# Altium project OVSR.PrjPcb
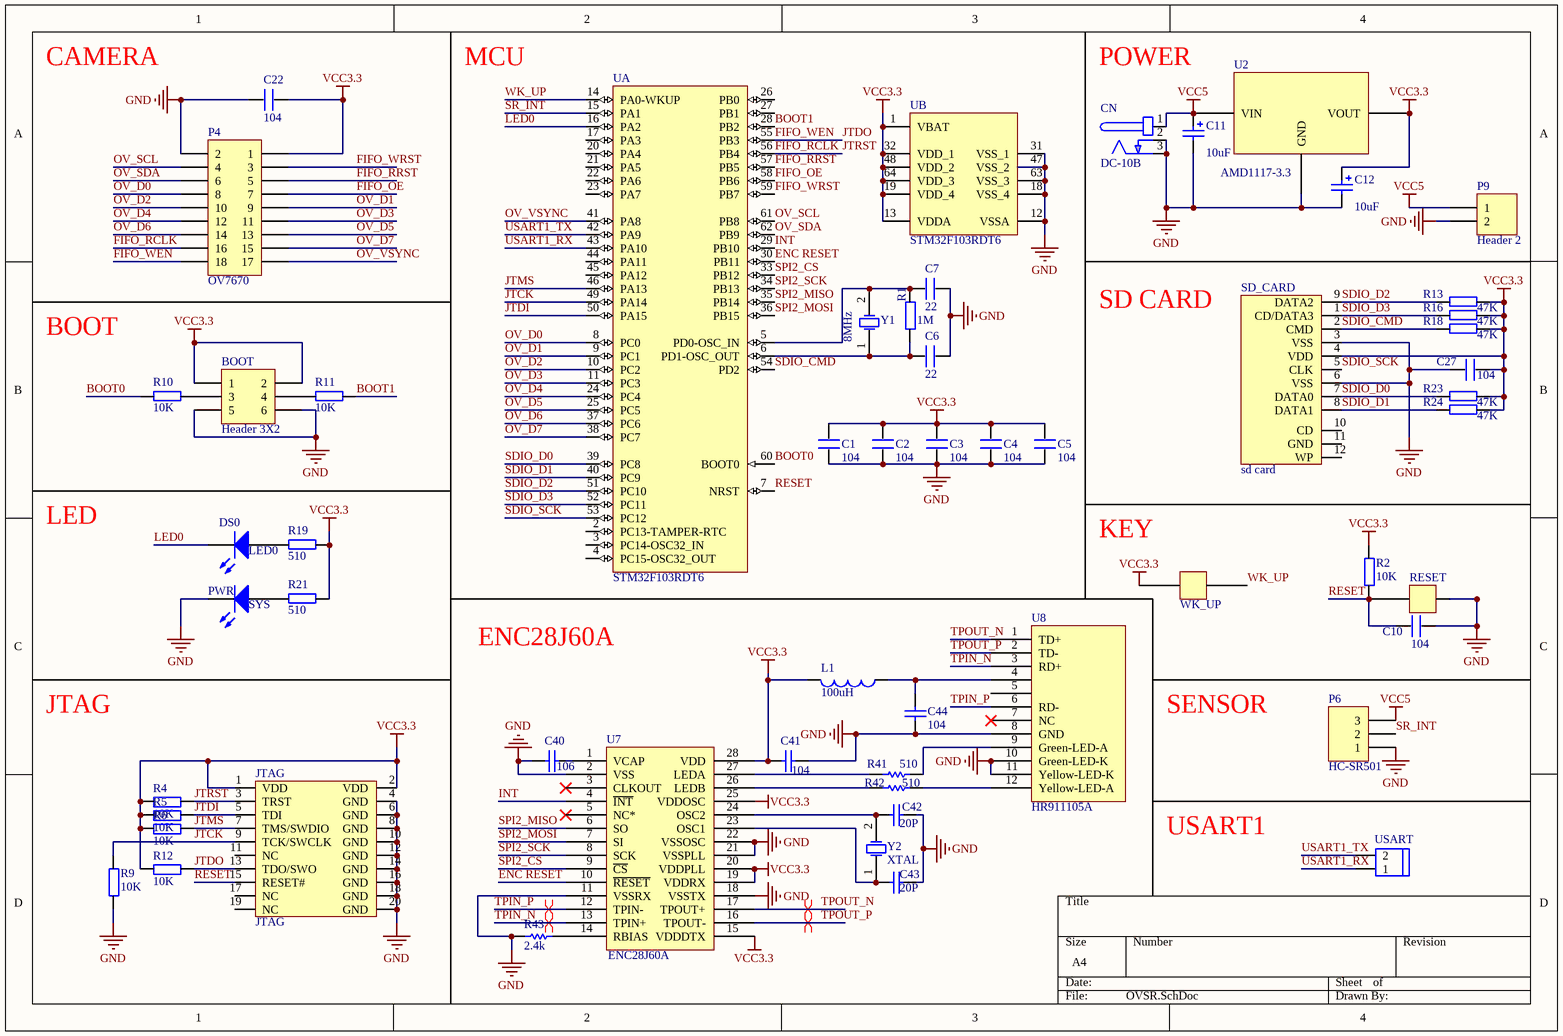
[diagram p0: OVSR.SchDoc]
1 sheet, 55 parts. Net scope: global (net labels, ports and power ports of the same name join across sheets).
Board file: OVSR.PcbDoc

## Sheet OVSR.SchDoc
size A4

### Parts
BOOT  Header 3X2  [HDR2X3]
C1  104  [CC1608-0603]
C2  104  [CC1608-0603]
C3  104  [CC1608-0603]
C4  104  [CC1608-0603]
C5  104  [CC1608-0603]
C6  22  [CC1608-0603]
C7  22  [CC1608-0603]
C10  104  [CC1608-0603]
C11  value 10uF  [CC1608-0603]  (hidden comment: Cap Pol2)
C12  value 10uF  [CC1608-0603]  (hidden comment: Cap Pol2)
C22  104  [CC1608-0603]
C27  104  [CC1608-0603]
C40  value 106  [Cr1608-0603]  (hidden comment: Cap)
C41  value 104  [Cr1608-0603]  (hidden comment: Cap)
C42  value 20P  [Cr1608-0603]  (hidden comment: Cap)
C43  value 20P  [Cr1608-0603]  (hidden comment: Cap)
C44  value 104  [Cr1608-0603]  (hidden comment: Cap)
CN  DC-10B  [DC10B]
DS0  LED0  [Cr2012-0805]
JTAG  JTAG  [JTAG_20]
L1  value 100uH  [1206]  (hidden comment: Inductor)
P4  OV7670  [HDR2X9]
P6  HC-SR501  [5.08-3]
P9  Header 2  [5.08-2]
PWR  SYS  [Cr2012-0805]
R1  1M  [CR1608-0603]
R2  10K  [CR1608-0603]
R4  10K  [CR1608-0603]
R5  10K  [CR1608-0603]
R6  10K  [CR1608-0603]
R9  10K  [CR1608-0603]
R10  10K  [CR1608-0603]
R11  10K  [CR1608-0603]
R12  10K  [CR1608-0603]
R13  47K  [CR1608-0603]
R16  47K  [CR1608-0603]
R18  47K  [CR1608-0603]
R19  510  [CR1608-0603]
R21  510  [CR1608-0603]
R23  47K  [CR1608-0603]
R24  47K  [CR1608-0603]
R41  value 510  [Cr1608-0603]  (hidden comment: Res1)
R42  value 510  [Cr1608-0603]  (hidden comment: Res1)
R43  value 2.4k  [Cr1608-0603]  (hidden comment: Res1)
RESET  SW  [RST_SW]  (value not drawn)
SD_CARD  sd card  [SDCARD_L]
U  STM32F103RDT6  [STM-LQFP64_N]  (parts A,B of 2)
U2  AMD1117-3.3  [SOT230P700X180-4N]
U7  ENC28J60A  [SSOP28_53MM_065P]
U8  HR911105A  [HR911105A]
USART  RS485  [HEAD2L-0.8]  (value not drawn)
WK_UP  SW  [RST_SW]  (value not drawn)
Y1  8MHz  [OSC1]
Y2  XTAL  [XTAL_US]

### Nets
GND: BOOT.5 BOOT.6 C1.1 C2.1 C3.1 C4.1 C5.1 C6.1 C7.1 C10.1 C11.2 C12.2 C22.2 C27.2 C40.1 C41.2 C42.2 C43.2 C44.2 CN.2(GND) CN.3(GND) JTAG.4(GND) JTAG.6(GND) JTAG.8(GND) JTAG.10(GND) JTAG.12(GND) JTAG.14(GND) JTAG.16(GND) JTAG.18(GND) JTAG.20(GND) P4.2 P6.1 P9.2 PWR.2(K) R9.1 R43.2 RESET.2 SD_CARD.3(VSS) SD_CARD.6(VSS) U.12(VSSA) U.18(VSS_4) U.31(VSS_1) U.47(VSS_2) U.63(VSS_3) U2.1(GND) U7.2(VSS) U7.11(VSSRX) U7.18(VSSTX) U7.21(VSSPLL) U7.22(VSSOSC) U8.8(GND) U8.10(Green-LED-K) U8.11(Yellow-LED-K)
VCC3.3: BOOT.1 BOOT.2 C1.2 C2.2 C3.2 C4.2 C5.2 C12.1 C22.1 C27.1 C41.1 JTAG.1(VDD) JTAG.2(VDD) L1.2 P4.1 R2.2 R4.1 R5.1 R6.1 R12.1 R13.1 R16.1 R18.1 R19.1 R21.1 R23.1 R24.1 SD_CARD.4(VDD) U.1(VBAT) U.13(VDDA) U.19(VDD_4) U.32(VDD_1) U.48(VDD_2) U.64(VDD_3) U2.2(VOUT) U7.15(VDDDTX) U7.19(VDDRX) U7.20(VDDPLL) U7.25(VDDOSC) U7.28(VDD) WK_UP.1
VCC5: C11.1 CN.1(+) P6.3 P9.1 U2.3(VIN)
BOOT0: R10.2 U.60(BOOT0)
BOOT1: R11.1 U.28(PB2)
ENC RESET: U.30(PB11) U7.10(~{RESET})
FIFO_OE: P4.7 U.58(PB6)
FIFO_RCLK: JTAG.3(TRST) P4.16 R4.2 U.56(PB4)  [also labelled JTRST]
FIFO_RRST: P4.5 U.57(PB5)
FIFO_WEN: JTAG.13(TDO/SWO) P4.18 R12.2 U.55(PB3)  [also labelled JTDO]
FIFO_WRST: P4.3 U.59(PB7)
INT: U.29(PB10) U7.4(~{INT})
JTCK: JTAG.9(TCK/SWCLK) R9.2 U.49(PA14)
JTDI: JTAG.5(TDI) R5.2 U.50(PA15)
JTMS: JTAG.7(TMS/SWDIO) R6.2 U.46(PA13)
LED0: DS0.2(K) U.16(PA2)
OV_D0: P4.8 U.8(PC0)
OV_D1: P4.9 U.9(PC1)
OV_D2: P4.10 U.10(PC2)
OV_D3: P4.11 U.11(PC3)
OV_D4: P4.12 U.24(PC4)
OV_D5: P4.13 U.25(PC5)
OV_D6: P4.14 U.37(PC6)
OV_D7: P4.15 U.38(PC7)
OV_SCL: P4.4 U.61(PB8)
OV_SDA: P4.6 U.62(PB9)
OV_VSYNC: P4.17 U.41(PA8)
RESET: C10.2 JTAG.15(RESET#) R2.1 RESET.1 U.7(NRST)
SDIO_CMD: R18.2 SD_CARD.2(CMD) U.54(PD2)
SDIO_D0: R23.2 SD_CARD.7(DATA0) U.39(PC8)
SDIO_D1: R24.2 SD_CARD.8(DATA1) U.40(PC9)
SDIO_D2: R13.2 SD_CARD.9(DATA2) U.51(PC10)
SDIO_D3: R16.2 SD_CARD.1(CD/DATA3) U.52(PC11)
SDIO_SCK: SD_CARD.5(CLK) U.53(PC12)
SPI2_CS: U.33(PB12) U7.9(~{CS})
SPI2_MISO: U.35(PB14) U7.6(SO)
SPI2_MOSI: U.36(PB15) U7.7(SI)
SPI2_SCK: U.34(PB13) U7.8(SCK)
SR_INT: P6.2 U.15(PA1)
TPIN_N: U7.13(TPIN+) U8.3(RD+)
TPIN_P: U7.12(TPIN-) U8.6(RD-)
TPOUT_N: U7.17(TPOUT+) U8.1(TD+)
TPOUT_P: U7.16(TPOUT-) U8.2(TD-)
USART1_RX: U.43(PA10) USART.1
USART1_TX: U.42(PA9) USART.2
WK_UP: U.14(PA0-WKUP) WK_UP.2
NetBOOT_3: BOOT.3 R10.1
NetBOOT_4: BOOT.4 R11.2
NetC6_2: C6.2 R1.1 U.6(PD1-OSC_OUT) Y1.1(OSC1)
NetC7_2: C7.2 R1.2 U.5(PD0-OSC_IN) Y1.2(OSC2)
NetC40_2: C40.2 U7.1(VCAP)
NetC42_1: C42.1 U7.24(OSC2) Y2.2(OSC2)
NetC43_1: C43.1 U7.23(OSC1) Y2.1(OSC1)
NetC44_1: C44.1 L1.1 U8.4
NetDS0_1: DS0.1(A) R19.2
NetPWR_1: PWR.1(A) R21.2
NetR41_1: R41.1 U7.27(LEDA)
NetR41_2: R41.2 U8.9(Green-LED-A)
NetR42_1: R42.1 U7.26(LEDB)
NetR42_2: R42.2 U8.12(Yellow-LED-A)
NetR43_1: R43.1 U7.14(RBIAS)

Not connected (* = marked no-connect by the designer): JTAG 11(NC) 17(NC) 19(NC); SD_CARD 10(CD) 11(GND) 12(WP); U 2(PC13-TAMPER-RTC) 3(PC14-OSC32_IN) 4(PC15-OSC32_OUT) 17(PA3) 20(PA4) 21(PA5) 22(PA6) 23(PA7) 26(PB0) 27(PB1) 44(PA11) 45(PA12); U7 3(CLKOUT)* 5(NC*)*; U8 5 7(NC)*

### Layout directives
differential pair: TPIN_N, TPIN_P, TPOUT_N, TPOUT_P

### Notes on the sheet
- CAMERA
- MCU
- POWER
- SD CARD
- BOOT
- LED
- KEY
- ENC28J60A
- JTAG
- SENSOR
- USART1

### Library data of the parts
BOOT = Header 3X2: Header, 3-Pin, Dual row; LatestRevisionDate: 17-Jul-2002; LatestRevisionNote: Re-released for DXP Platform.; Publisher: Altium Limited
C1-C5 C10 C22 C27 = C
C6 C7 = C_1
C11 C12 = Cap Pol2: Polarized Capacitor (Axial); Published: 8-Jun-2000; LatestRevisionDate: 17-Jul-2002; LatestRevisionNote: Re-released for DXP Platform.; Publisher: Altium Limited
C40-C44 = Cap: Capacitor; Published: 8-Jun-2000; LatestRevisionDate: 17-Jul-2002; LatestRevisionNote: Re-released for DXP Platform.; PackageReference: RAD-0.3; Publisher: Altium Limited
CN = PJ202A
DS0 PWR = LED2: Typical RED, GREEN, YELLOW, AMBER GaAs LED; Published: 8-Jun-2000; LatestRevisionDate: 17-Jul-2002; LatestRevisionNote: Re-released for DXP Platform.; PackageDocument: Feb-2002; PackageReference: 3.2X1.6X1.1; Publisher: Altium Limited
L1 = Inductor: Code_IEC: 1005; Published: 8-Jun-2000; LatestRevisionDate: 29-May-2009; LatestRevisionNote: IPC-7351 Footprint Added.; PackageReference: 0402-A; Publisher: Altium Limited; PackageDescription: Chip Inductor; Code_JEITA: 0402
P4 = Header 9X2: Header, 9-Pin, Dual row; LatestRevisionDate: 17-Jul-2002; LatestRevisionNote: Re-released for DXP Platform.; Publisher: Altium Limited
P6 = Header 3: Header, 3-Pin; LatestRevisionDate: 17-Jul-2002; LatestRevisionNote: Re-released for DXP Platform.; Publisher: Altium Limited
P9 = Header 2: Header, 2-Pin; LatestRevisionDate: 17-Jul-2002; LatestRevisionNote: Re-released for DXP Platform.; Publisher: Altium Limited
R1 R2 R4-R6 R9-R13 R16 R18 R19 R21 R23 R24 = R
R41-R43 = Res1: Resistor; Published: 8-Jun-2000; LatestRevisionDate: 17-Jul-2002; LatestRevisionNote: Re-released for DXP Platform.; PackageReference: AXIAL-0.3; Publisher: Altium Limited
U = STM32F103RDT6: ARM Cortex-M3 32-bit MCU, 384 KB Flash, 64 KB Internal RAM, 51 I/Os, 64-pin LQFP, -40 to 85 degC, Tray; A/D Converter: 3x12-bit (16 Channel); D/A Converter: 2x12-bit (2 Channel); FLASH Size (Prog) (kB): 384; I/Os (High Current): 51; Internal RAM Size (kB): 64; Operating Frequency(F) (Processor speed) (MHz): 72; Supply Voltage(Vcc) min (V): 2; DatasheetVersion: Rev. 8; PackageVersion: Rev. 4, 06/2013; PackageReference: LQFP64; PackageDescription: 64-Pin Low Profile Quad Flat Package, 10 x 10 mm Body, 0.5 mm Pitch; Supplier 1: Digi-Key; Supplier Part Number 1: 497-11528-ND; Supplier 2: Farnell; Supplier Part Number 2: 1624137; Supplier 3: Newark; Supplier Part Number 3: 01P4100; Supplier 4: Newark; Supplier Part Number 4: 57P1230; Supplier 5: Mouser; Supplier Part Number 5: 511-STM32F103RDT6; Core: ARM Cortex-M3; Packing: Tray; Mounting Technology: Surface Mount; PartNumber: STM32F103RDT6; ComponentLink1Description: Manufacturer URL; ComponentLink1URL: http://www.st.com/web/en/home.html; ComponentLink2Description: Datasheet; ComponentLink2URL: http://www.st.com/st-web-ui/static/active/en/resource/technical/document/datasheet/CD00191185.pdf; ComponentLink3Description: Package Specification; ComponentLink3URL: http://www.st.com/st-web-ui/static/active/en/resource/technical/document/datasheet/DM00037051.pdf
U2 = AMS1117-3.3: AMD1117-3.3芯片
USART = HEAD2
Y1 = XTAL: Crystal Oscillator; Published: 8-Jun-2000; LatestRevisionDate: 17-Jul-2002; LatestRevisionNote: Re-released for DXP Platform.; Publisher: Altium Limited
Y2 = XTAL: Crystal Oscillator; VALUE: 25M; Published: 8-Jun-2000; LatestRevisionDate: 17-Jul-2002; LatestRevisionNote: Re-released for DXP Platform.; PackageReference: R38; Publisher: Altium Limited